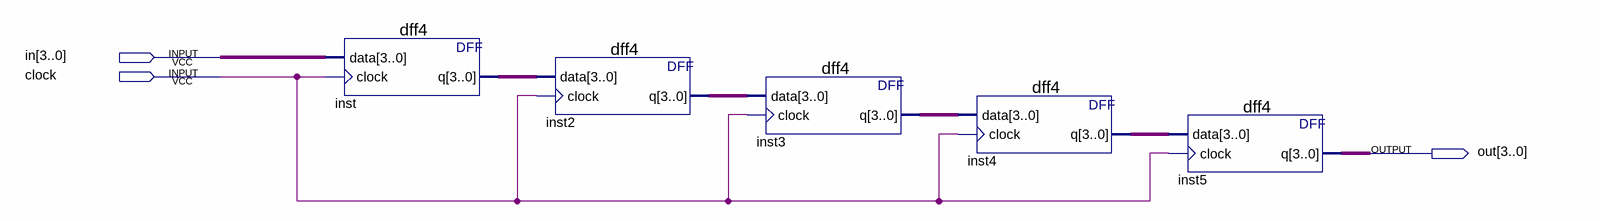
[diagram p0: schematic sheet]
// Quartus schematic read_id_dff.bdf as structural Verilog: 5 symbols, 3 pins
module read_id_dff (
  input  [3:0] in,
  input  clock,
  output [3:0] out
);

  wire [3:0] inst2_q, inst3_q, inst4_q, inst_q;

  dff4 inst (.data(in), .clock(clock), .q(inst_q));
  dff4 inst2 (.data(inst_q), .clock(clock), .q(inst2_q));
  dff4 inst3 (.data(inst2_q), .clock(clock), .q(inst3_q));
  dff4 inst4 (.data(inst3_q), .clock(clock), .q(inst4_q));
  dff4 inst5 (.data(inst4_q), .clock(clock), .q(out));
endmodule
